# Altium schematic sheet Auxiliary.SchDoc: Auxiliary Components
size A4; DocumentNumber: 22; SheetNumber: 22; SheetTotal: 50
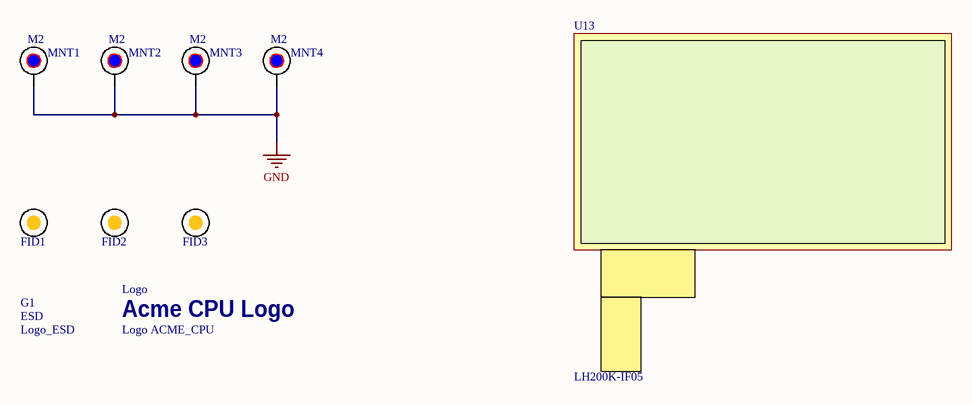
[diagram p0: Auxiliary.SchDoc]

## Parts
FID1  N/A  [Fiducial]  (value not drawn)  (no BOM)
FID2  N/A  [Fiducial]  (value not drawn)  (no BOM)
FID3  N/A  [Fiducial]  (value not drawn)  (no BOM)
G1  Logo_ESD  [Logo_ESD]  (no BOM)
Logo  Logo ACME_CPU  [LOGO_ACME_CPU]  (no BOM)
MNT1  MountHole M2. Nothing to buy or mount  [MountHole_M2]  (value not drawn)  (no BOM)
MNT2  MountHole M2. Nothing to buy or mount  [MountHole_M2]  (value not drawn)  (no BOM)
MNT3  MountHole M2. Nothing to buy or mount  [MountHole_M2]  (value not drawn)  (no BOM)
MNT4  MountHole M2. Nothing to buy or mount  [MountHole_M2]  (value not drawn)  (no BOM)
U13  LH200K-IF05  (mechanical)

## Nets
GND: MNT1.1 MNT2.1 MNT3.1 MNT4.1

## Notes on the sheet
- Title
- Size:
- Date:
- A4
- Number:
- Time:
- Revision:
- Sheet
- of
- File:
- (in symbol Logo ACME_CPU) Acme CPU Logo
- (in symbol Logo_ESD) ESD
- (in symbol MountHole_M2) M2

## Library data of the parts
FID1-FID3 = Fiducial: Fiducial mark.  There is nothing to buy or mount.; ClassName: FiducialMark; CompType: Fiducial; Manufacturer: N/A; MountType: N/A; PackageReference: Fiducial; Manufacturer Part Number: N/A
MNT1-MNT4 = MountHole_M2: PCB Mount Hole. There is nothing to buy or mount.
U13 = MOD LH200K-IF05 240x320 2-inch TFT LCD Display: 2” TFT LCD Display.; Manufacturer: Shenzhen Limito Technology Inc.; Mount: Not Mounted on PCB; Manufacturer Part Number: LH200K-IF05
Logo = Logo ACME_CPU: ClassName: PCB_FEATURE